# EAGLE design OneRelayMysensors (EAGLE 6.5.0)
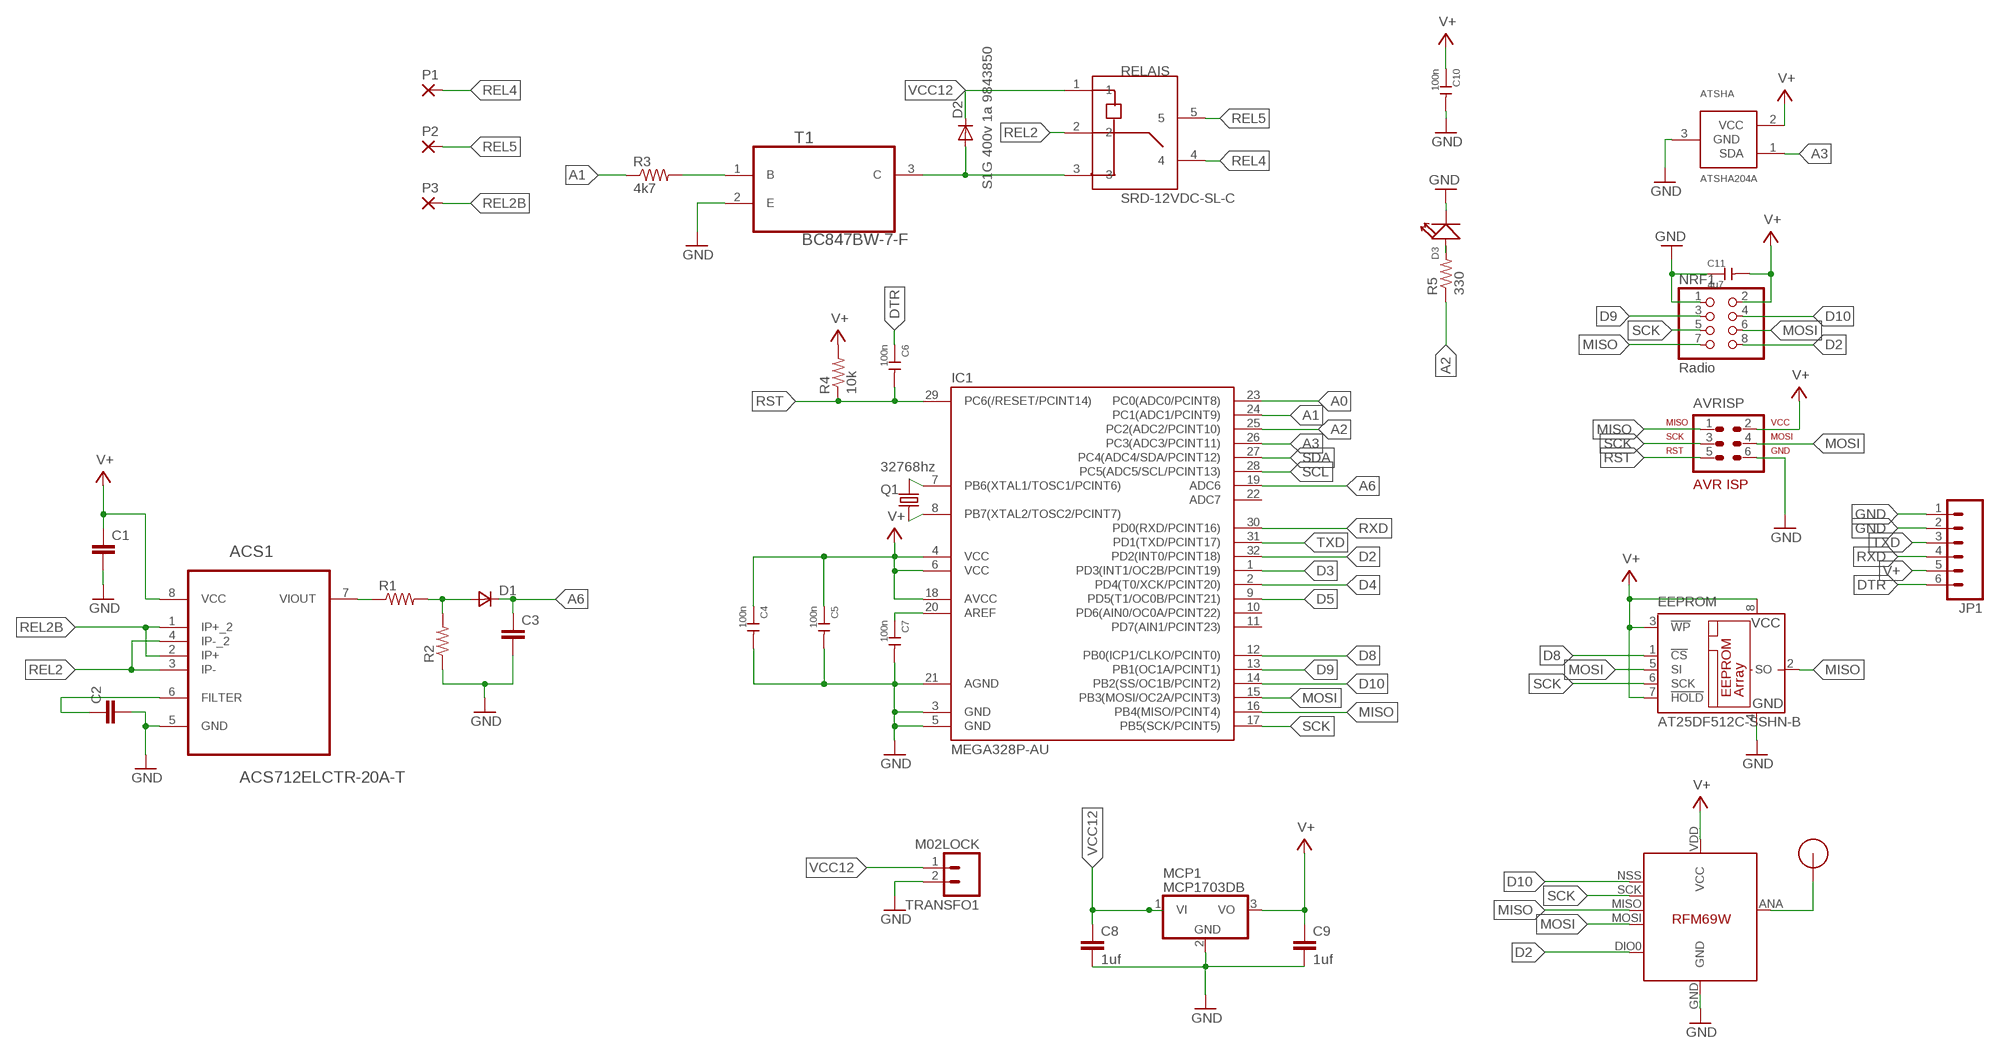
[diagram p0: schematic, sheet 1]

## Parts
$1_28_$  RFM12B_ANTENNA  [RFM12B-ANTENNA]
ACS1  ACS712ELCTR-20A-T  [SOIC127P600X175-8N]
ATSHA  ATSHA204A  [SOT23]
AVRISP  AVR-ISP-6VERT  [AVR-ISP-6]
C1  CAP0805  [0805]
C2  CAP0805  [0805]
C3  CAP0805  [0805]
C4  100n  CAP-1206  [C1206]
C5  100n  CAP-1206  [C1206]
C6  100n  CAP-1206  [C1206]
C7  100n  CAP-1206  [C1206]
C8  1uf  CAP1206  [1206]
C9  1uf  CAP1206  [1206]
C10  100n  CAP-1206  [C1206]
C11  4u7  CAP-1206  [C1206]
D1  DSOD323  [SOD323]
D2  S1G 400v 1a 9843850  DIODE-DO214AC  [DO214AC]
D3  LED-0805  [LED-0805]
EEPROM  AT25DF512C-SSHN-B  25AA080SN  [SO-08]
IC1  MEGA328P-AU  MEGA48/88/168-AU  [TQFP32-08]
JP1  M06NO_SILK_FEMALE_PTH  [1X06_NO_SILK]
MCP1  MCP1703DB  [SOT223]
NRF1  Radio  PINHD-2X4  [2X04]
P1  2,54/1,1  [2,54/1,1]
P2  2,54/1,1  [2,54/1,1]
P3  2,54/1,1  [2,54/1,1]
Q1  32768hz  CRYSTAL-306010055  [2P-L3.2XW1.5MM]
R1  RESISTOR0805-RES  [0805]
R2  RESISTOR0805-RES  [0805]
R3  4k7  RESISTOR1206  [1206]
R4  10k  RESISTOR1206  [1206]
R5  330  RESISTOR1206  [1206]
RELAIS  SRD-12VDC-SL-C  [SRD-12VDC-SL-C]
RFM1  RFM69  [RFM69W-MINPADS]
T1  BC847BW-7-F  [SOT65P210X110-3N]
TRANSFO1  M02LOCK  [1X02_LOCK]

## Nets
A0: IC1.23(PC0(ADC0/PCINT8))
A1: IC1.24(PC1(ADC1/PCINT9)) R3.1
A2: IC1.25(PC2(ADC2/PCINT10)) R5.1
A3: ATSHA.1(SDA) IC1.26(PC3(ADC3/PCINT11))
A6: C3.1 D1.1(C) IC1.19(ADC6)
D2: IC1.32(PD2(INT0/PCINT18)) NRF1.8 RFM1.DIO0
D3: IC1.1(PD3(INT1/OC2B/PCINT19))
D4: IC1.2(PD4(T0/XCK/PCINT20))
D5: IC1.9(PD5(T1/OC0B/PCINT21))
D8: EEPROM.1(!CS) IC1.12(PB0(ICP1/CLKO/PCINT0))
D9: IC1.13(PB1(OC1A/PCINT1)) NRF1.3
D10: IC1.14(PB2(SS/OC1B/PCINT2)) NRF1.4 RFM1.NSS(SEL)
DTR: C6.1 JP1.6
GND [Power]: ACS1.5(GND) ATSHA.3(GND) AVRISP.6 C1.2 C2.2 C3.2 C4.2 C5.2 C7.2 C8.2 C9.2 C10.2 C11.1 D3.- EEPROM.4(GND) IC1.3(GND) IC1.5(GND) IC1.21(AGND) JP1.1 JP1.2 MCP1.2(GND) NRF1.1 R2.1 RFM1.GND T1.2(E) TRANSFO1.2
MISO: AVRISP.1 EEPROM.2(SO) IC1.16(PB4(MISO/PCINT4)) NRF1.7 RFM1.MISO
MOSI: AVRISP.4 EEPROM.5(SI) IC1.15(PB3(MOSI/OC2A/PCINT3)) NRF1.6 RFM1.MOSI
N$1: IC1.7(PB6(XTAL1/TOSC1/PCINT6)) Q1.1
N$2: IC1.8(PB7(XTAL2/TOSC2/PCINT7)) Q1.2
N$3: D3.+ R5.2
N$4: C7.1 IC1.20(AREF)
N$5: $1_28_$.P$1 RFM1.ANA(ANT)
N$8: D2.A RELAIS.3 T1.3(C)
N$10: R3.2 T1.1(B)
N$14: ACS1.6(FILTER) C2.1
N$16: ACS1.7(VIOUT) R1.1
N$17: D1.2(A) R1.2 R2.2
REL2: ACS1.3(IP-) ACS1.4(IP-_2) RELAIS.2
REL2B: ACS1.1(IP+_2) ACS1.2(IP+) P3.1(P)
REL4: P1.1(P) RELAIS.4
REL5: P2.1(P) RELAIS.5
RST: AVRISP.5 C6.2 IC1.29(PC6(/RESET/PCINT14)) R4.1
RXD: IC1.30(PD0(RXD/PCINT16)) JP1.4
SCK: AVRISP.3 EEPROM.6(SCK) IC1.17(PB5(SCK/PCINT5)) NRF1.5 RFM1.SCK
SCL: IC1.28(PC5(ADC5/SCL/PCINT13))
SDA: IC1.27(PC4(ADC4/SDA/PCINT12))
TXD: IC1.31(PD1(TXD/PCINT17)) JP1.3
V+ [Power]: ACS1.8(VCC) ATSHA.2(VCC) AVRISP.2 C1.1 C4.1 C5.1 C9.1 C10.1 C11.2 EEPROM.3(!WP) EEPROM.7(!HOLD) EEPROM.8(VCC) IC1.4(VCC) IC1.6(VCC) IC1.18(AVCC) JP1.5 MCP1.3(VO) NRF1.2 R4.2 RFM1.VDD(VCC)
VCC12: C8.1 D2.C MCP1.1(VI) RELAIS.1 TRANSFO1.1
Unconnected: IC1.10(PD6(AIN0/OC0A/PCINT22)) IC1.11(PD7(AIN1/PCINT23)) IC1.22(ADC7)

## Library data of the parts
$1_28_$ = LowPowerLab:RFM12B_ANTENNA
ACS1 = pmo_lib:ACS712ELCTR-20A-T: Linear Current Sensor; MPN: ACS712ELCTR-20A-T; OC_FARNELL: 1329624; OC_NEWARK: 31M3133; PACKAGE: SOIC-8; SUPPLIER: Allegro
ATSHA = Sensor:ATSHA204A
AVRISP = avr-7:AVR-ISP-6: AVR ISP-6 Serial Programming Header
C1-C3 = SparkFun-Passives:CAP: Capacitor Standard 0603 ceramic capacitor, and 0.1" leaded capacitor.
C4-C7 C10 C11 = Discrete:CAP: Ceramic Capacitors
C8 C9 = SparkFun-Capacitors:CAP: Capacitor Standard 0603 ceramic capacitor, and 0.1" leaded capacitor.
D1 = zetex:D: DIODE; MPN: CDSOD323-T05C; OC_FARNELL: 1824860; OC_NEWARK: 79R6078
D2 = diode:DIODE-: DIODE
D3 = Discrete:LED
EEPROM = microchip:25*: Serial EEPROM 4K/ 8K , SPI bus; MF: MICROCHIP; MPN: 25AA080/SN; OC_FARNELL: 1816072; OC_NEWARK: 92C7351
IC1 = avr-7:MEGA48/88/168
JP1 = SparkFun-Connectors:M06: Header 6 Standard 6-pin 0.1" header. Use with straight break away headers (SKU : PRT-00116), right angle break away headers (PRT-00553), swiss pins (PRT-00743), machine pins (PRT-00117), and female headers (PRT-00115). Molex polarized connector foot print use with SKU : PRT-08094 with associated crimp pins and housings. NOTES ON THE VARIANTS LOCK and LOCK_LONGPADS... This footprint was designed to help hold the alignment of a through-hole component (i.e. 6-pin header) while soldering it into place. You may notice that each hole has been shifted either up or down by 0.005 of an inch from it's more standard position (which is a perfectly straight line). This slight alteration caused the pins (the squares in the middle) to touch the edges of the holes. Because they are alternating, it causes a "brace" to hold the component in place. 0.005 has proven to be the perfect amount of "off-center" position when using our standard breakaway headers. Although looks a little odd when you look at the bare footprint, once you have a header in there, the alteration is very hard to notice. Also,if you push a header all the way into place, it is covered up entirely on the bottom side. This idea of altering the position of holes to aid alignment will be further integrated into the Sparkfun Library for other footprints. It can help hold any component with 3 or more connection pins.; PROD_ID: CONN-08437
MCP1 = linear:MCP1703: 250 mA, 16V, Low Quiescent Current LDO Regulator Source: http://ww1.microchip.com/downloads/en/DeviceDoc/22049b.pdf
NRF1 = pinhead:PINHD-2X4: PIN HEADER
P1-P3 = wirepad:2,54/1,1: THROUGH-HOLE PAD
Q1 = Discrete:CRYSTAL*
R1-R3 = SparkFun-Resistors:RESISTOR: Resistor Basic schematic elements and footprints for 0603, 1206, and PTH resistors.
R4 R5 = SparkFun-Passives:RESISTOR: Resistor Basic schematic elements and footprints for 0603, 1206, and PTH resistors.
RELAIS = pmo_lib:SRD-12VDC-SL-C
RFM1 = LowPowerLab:RFM69
T1 = pmo_lib:BC847BW-7-F: TRANSISTOR; MPN: BC847BW-7-F; OC_FARNELL: 1773619; OC_NEWARK: 51R6394; PACKAGE: SOT-323-3; SUPPLIER: Diodes Inc
TRANSFO1 = SparkFun-Connectors:M02: Standard 2-pin 0.1" header. Use with - straight break away headers ( PRT-00116) - right angle break away headers (PRT-00553) - swiss pins (PRT-00743) - machine pins (PRT-00117) - female headers (PRT-00115) Molex polarized connector foot print use with: PRT-08233 with associated crimp pins and housings. 2.54_SCREWTERM for use with PRT-10571. 3.5mm Screw Terminal footprints for PRT-08084 5mm Screw Terminal footprints for use with PRT-08433

## Net classes
0 default: width 0.203 mm
1 Power: width 0.406 mm

## Board
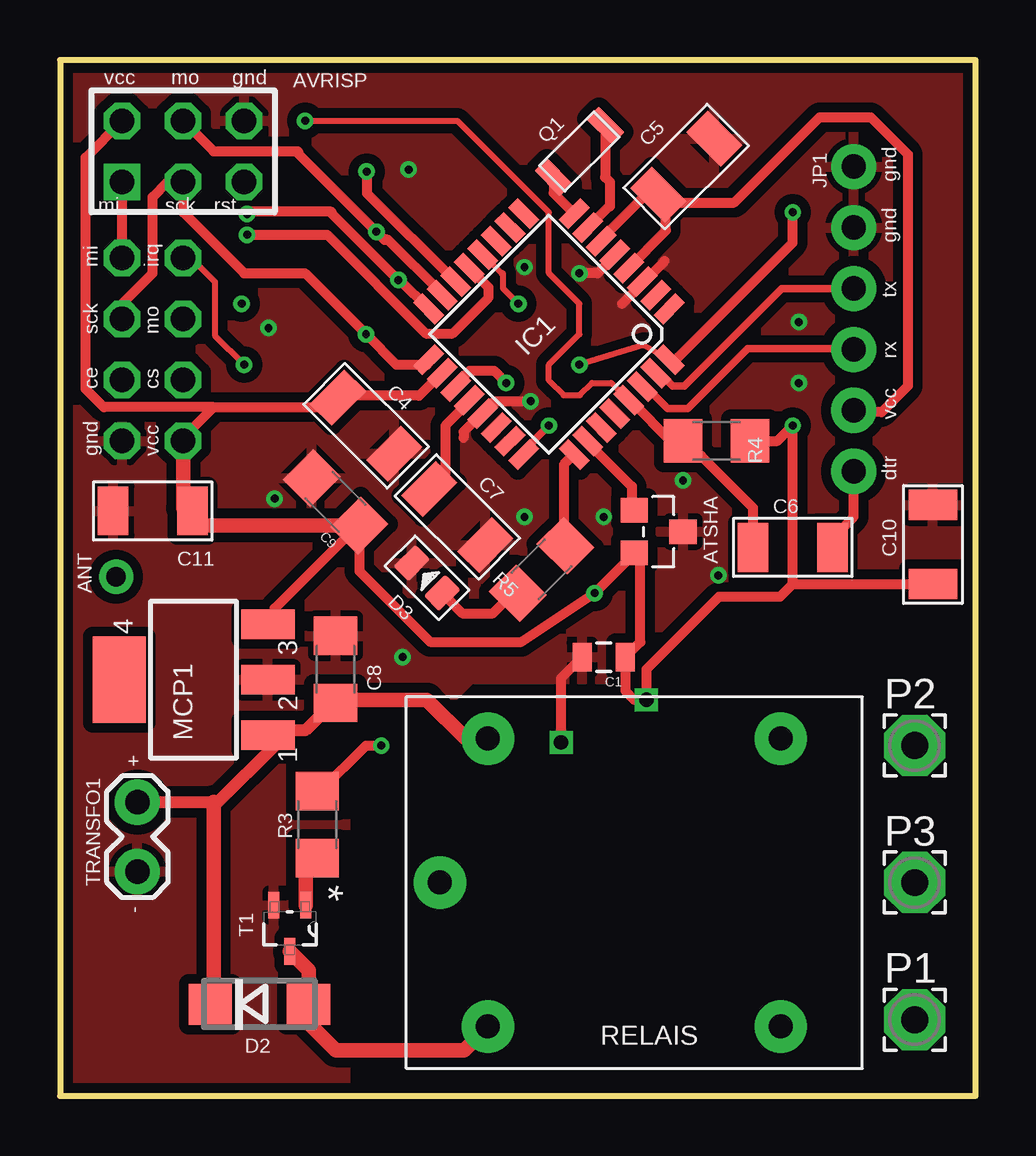
[diagram p1: board, top side]
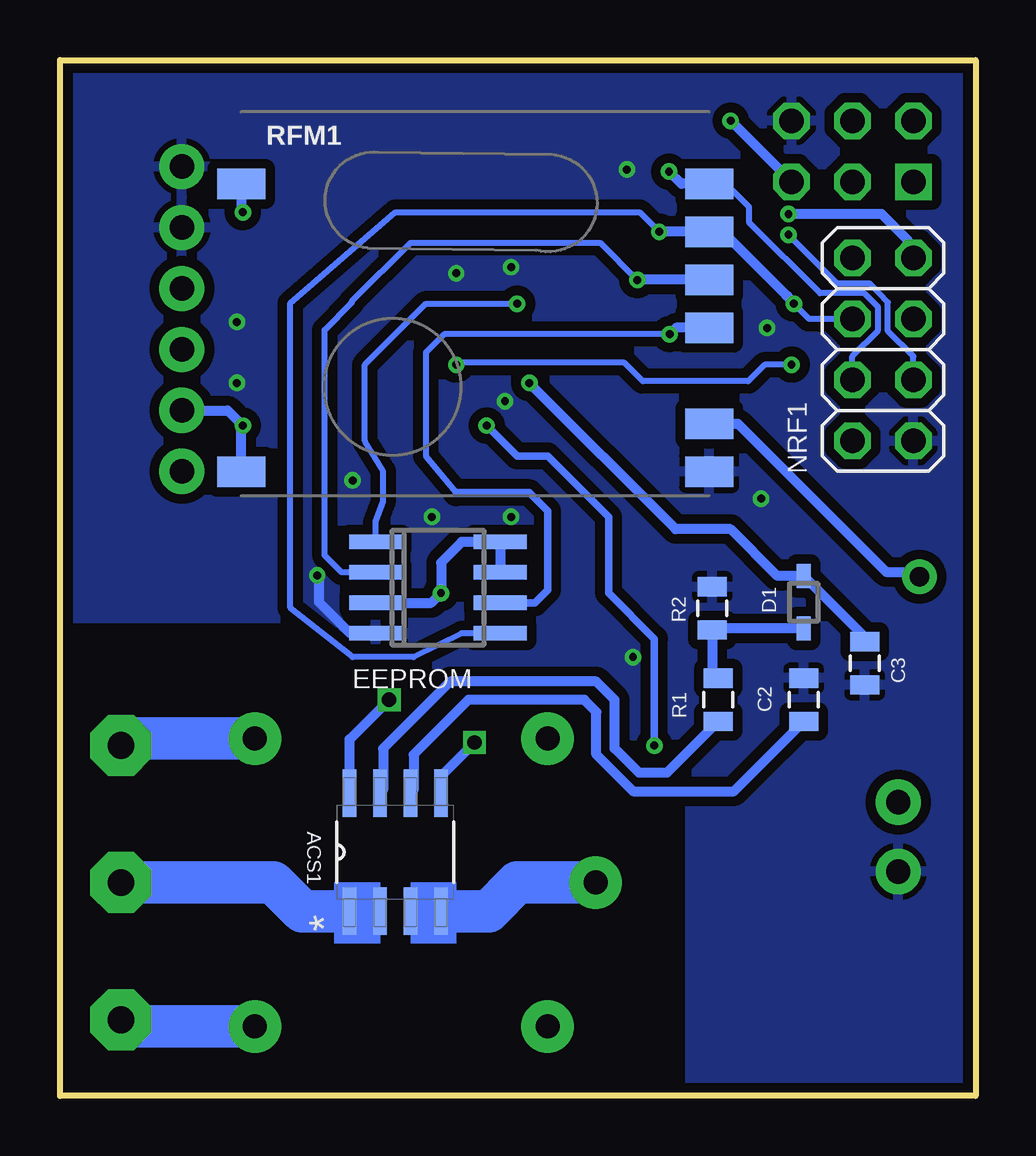
[diagram p2: board, bottom side, seen from below]

Size 38.15 x 43.18 mm. Coordinates in mm from the lower left corner, seen from the top.
Outline: 0,0 38.15,0 38.15,43.18 0,43.18 0,0
Copper layers (1*16): Top 0.0356mm / dielectric 1.5011mm / Bottom 0.0356mm
Design rules "LaenPCBOrder": minimum track width 6mil, minimum drill 13mil, track to track 6mil, track to pad 6mil, pad to pad 6mil, via to via 6mil, smd to smd 6mil, copper to edge 15mil, drill to drill 6mil, minimum pad ring 7mil, minimum via ring 7mil, stop-mask expansion 3mil, vias tented up to drill 0mil, thermal gap 10mil

### Footprints (pad centres in the part's own frame; a part is rotated, then mirrored left to right if it is on the bottom)
RFM12B-ANTENNA = drill 0.8 pad 1.422: P$1 0,0
SOIC127P600X175-8N = smd 1.981 x 0.559: 1 -2.464,1.905; 2 -2.464,0.635; 3 -2.464,-0.635; 4 -2.464,-1.905; 5 2.464,-1.905; 6 2.464,-0.635; 7 2.464,0.635; 8 2.464,1.905
SOT23 = smd 1.016 x 1.143: 1 -0.889,-1.016; 2 0.889,-1.016; 3 0,1.016
AVR-ISP-6 = drill 1.016 square: 1 -2.54,-1.27 | drill 1.016 octagon: 2 -2.54,1.27; 3 0,-1.27; 4 0,1.27; 5 2.54,-1.27; 6 2.54,1.27
0805 = smd 0.8 x 1.2: 1 -0.9,0; 2 0.9,0
C1206 = smd 1.27 x 2.032: 1 -1.651,0; 2 1.651,0
1206 = smd 1.6 x 1.8: 1 -1.4,0; 2 1.4,0
SOD323 = smd 1 x 0.6: 1 -1.1,0; 2 1.1,0
DO214AC = smd 1.8 x 1.7: A 2.05,0; C -2.05,0
LED-0805 = smd 0.889 x 1.27: + -0.889,0; - 0.889,0
SO-08 = smd 0.6 x 2.2: 1 -1.905,-2.6; 2 -0.635,-2.6; 3 0.635,-2.6; 4 1.905,-2.6; 5 1.905,2.6; 6 0.635,2.6; 7 -0.635,2.6; 8 -1.905,2.6
TQFP32-08 = smd 1.27 x 0.559: 1 -4.293,2.8; 2 -4.293,2; 3 -4.293,1.2; 4 -4.293,0.4; 5 -4.293,-0.4; 6 -4.293,-1.2; 7 -4.293,-2; 8 -4.293,-2.8; 17 4.293,-2.8; 18 4.293,-2; 19 4.293,-1.2; 20 4.293,-0.4; 21 4.293,0.4; 22 4.293,1.2; 23 4.293,2; 24 4.293,2.8 | smd 0.559 x 1.27: 9 -2.8,-4.293; 10 -2,-4.293; 11 -1.2,-4.293; 12 -0.4,-4.293; 13 0.4,-4.293; 14 1.2,-4.293; 15 2,-4.293; 16 2.8,-4.293; 25 2.8,4.293; 26 2,4.293; 27 1.2,4.293; 28 0.4,4.293; 29 -0.4,4.293; 30 -1.2,4.293; 31 -2,4.293; 32 -2.8,4.293
1X06_NO_SILK = drill 1.016 pad 1.88: 1 0,0; 2 2.54,0; 3 5.08,0; 4 7.62,0; 5 10.16,0; 6 12.7,0
SOT223 = smd 1.219 x 2.235: 1 -2.311,-3.099; 2 0,-3.099; 3 2.311,-3.099 | smd 3.6 x 2.2: 4 0,3.099
2X04 = drill 1.016 octagon: 1 -3.81,-1.27; 2 -3.81,1.27; 3 -1.27,-1.27; 4 -1.27,1.27; 5 1.27,-1.27; 6 1.27,1.27; 7 3.81,-1.27; 8 3.81,1.27
2,54/1,1 = drill 1.118 pad 2.54 octagon: 1 0,0
2P-L3.2XW1.5MM = smd 0.762 x 1.524: 1 -1.524,0; 2 1.524,0
SRD-12VDC-SL-C = drill 1 pad 2.184: 1 0,6; 2 -2,0; 3 0,-6; 4 12.2,-6; 5 12.2,6
RFM69W-MINPADS = smd 2 x 1.27: ANA 8,-5; DIO0 -11.5,5; GND 8,-7; MISO 8,1; MOSI 8,3; NSS 8,5; SCK 8,-1; VDD -11.5,-7
SOT65P210X110-3N = smd 1.118 x 0.457: 1 -0.965,0.66; 2 -0.965,-0.66; 3 0.965,0
1X02_LOCK = drill 1.016 pad 1.88: 1 -0.178,0; 2 2.718,0

### Placement (x,y rotation side)
$1_28_$  2.34,21.64 0 top
ACS1  24.18,10.16 90 bottom
ATSHA  24.94,23.52 270 top
AVRISP  5.13,39.37 0 top
C1  22.66,18.29 180 top
C2  7.16,16.51 90 bottom
C3  4.62,18.03 270 bottom
C4  12.75,27.94 315 top
C5  26.09,38.73 45 top
C6  30.53,22.86 180 top
C7  16.56,24.13 315 top
C8  11.48,17.78 90 top
C9  11.48,24.77 135 top
C10  36.37,22.99 90 top
C11  3.86,24.38 0 top
D1  7.16,20.57 270 bottom
D2  8.31,3.81 0 top
D3  15.29,21.59 135 top
EEPROM  22.4,21.18 270 bottom
IC1  20.37,31.75 225 top
JP1  33.07,38.73 270 top
MCP1  5.56,17.35 90 top
NRF1  3.86,31.11 90 bottom
P1  35.61,3.17 0 top
P2  35.61,14.61 0 top
P3  35.61,8.89 0 top
Q1  21.64,39.37 225 top
R1  10.72,16.51 90 bottom
R2  10.97,20.32 270 bottom
R3  10.72,11.3 270 top
R4  27.36,27.3 0 top
R5  20.07,21.95 225 top
RELAIS  17.83,8.89 0 top
RFM1  19.1,33.02 0 bottom
T1  9.58,6.99 270 top
TRANSFO1  3.23,12.06 270 top

### Tracks (layer width: path | path; a pad name or v marks a point on that pad's centre or on a via)
A1  (via drill 0.33 pad 0.61)
  Top 0.305: IC1.24 19.32,26.89 v20.37,27.94
  Top 0.406: R3.1 10.85,12.7 12.75,14.61 v13.39,14.61
  Bottom 0.305: v13.39,14.61 13.39,19.05 15.29,20.95 15.29,24.13 17.83,26.67 19.1,26.67 v20.37,27.94
A2
  Top 0.406: IC1.25 21,26.31 21,22.99 R5.1
A3
  Top 0.406: IC1.26 21.99,27.23 23.82,25.4 23.82,24.51 ATSHA.1
A6  (via drill 0.33 pad 0.61)
  Top 0.406: IC1.19 16.49,29.64 17.07,30.23 18.08,30.23 v18.59,29.72
  Bottom 0.406: v18.59,29.72 12.5,23.62 10.21,23.62 8.26,21.67 D1.1 4.62,19.13 C3.1
D2  (via drill 0.33 pad 0.61)
  Top 0.254: NRF1.8 5.46,34.92 6.45,33.93 6.45,31.7 v7.67,30.48 | IC1.32 24.31,31.29 v21.64,30.48
  Top 0.406: IC1.32 25.67,30.7 30.53,35.56 v30.53,36.83
  Bottom 0.254: v7.67,30.48 8.79,30.48 9.47,29.79 13.87,29.79 14.63,30.56 21.56,30.56 v21.64,30.48
  Bottom 0.406: RFM1.DIO0 30.6,36.9 v30.53,36.83
D8  (via drill 0.33 pad 0.61)
  Top 0.254: v19.1,33.02 18.47,33.66 18.47,34.29 18.4,34.29 IC1.12
  Bottom 0.254: EEPROM.1 25,23.94 24.69,24.77 24.69,26.04 25.45,27.3 25.45,30.48 22.91,33.02 v19.1,33.02
D9  (via drill 0.33 pad 0.61)
  Top 0.406: v7.8,35.89 11.12,35.89 15.24,31.77 16.36,31.77 17.86,33.27 17.86,33.7 IC1.13
  Bottom 0.254: NRF1.3 2.59,30.84 3.66,31.88 3.66,33.07 4.42,33.86 5.77,33.86 v7.8,35.89
D10  (via drill 0.33 pad 0.61)
  Top 0.406: IC1.14 12.8,37.62 12.8,38.51 v12.78,38.53
  Bottom 0.254: NRF1.4 5.13,30.84 4.06,31.9 4.06,32.87 4.65,33.45 6.48,33.45 9.45,36.42 9.45,37.06 10.41,38.02 RFM1.NSS
  Bottom 0.406: RFM1.NSS 12.26,38.02 v12.78,38.53
DTR
  Top 0.406: C6.1 32.18,23.24 33.07,24.13 JP1.6
GND  (via drill 0.33 pad 0.61, 0.6)
  Top 0.406: v20.88,14.73 20.88,17.41 C1.2 | 25.2,34.8 24.34,33.94 IC1.3 24.25,33.86 23.42,33.02 | IC1.5 23.12,35.01 22.4,34.29 v21.64,34.29 | 16.81,27.43 16.81,27.69 17.56,28.43 IC1.21 17.62,28.49 18.08,28.96 v19.61,28.96
  Bottom 0.406: EEPROM.4 25.03,19.25 26.03,19.25 27.36,20.57 27.36,21.61 v27.43,21.69 | ACS1.5 22.28,13.34 v20.88,14.73
  other vias: 25.96,25.65 19.35,34.54 19.35,24.13 30.78,32.26 14.53,38.61 8.69,32 14.27,18.29 22.66,24.13 30.78,29.72 8.94,24.89
  pour Bottom (isolate 0.406, rank 6): -7.57,45.72 -7.57,-2.54 41.96,-2.54 41.96,45.72
  pour Top (isolate 0.406, rank 6): -5.03,-3.81 43.23,-3.81 43.23,46.99 -5.03,46.99
MISO  (via drill 0.33 pad 0.61)
  Top 0.406: NRF1.7 AVRISP.1 | IC1.16 14.15,34.01 v14.1,34.01 11.31,36.8 11.31,36.85 7.9,36.85 v7.8,36.75
  Bottom 0.254: EEPROM.2 26.42,21.82 27.13,22.53 27.13,31.93 25.98,33.07 25.98,33.12 23.55,35.56 15.65,35.56 v14.1,34.01
  Bottom 0.406: v14.1,34.01 14.09,34.02 RFM1.MISO 10.93,34.19 | v7.8,36.75 3.91,36.75 2.84,35.69 2.84,35.18 NRF1.7
MOSI  (via drill 0.33 pad 0.61)
  Top 0.406: AVRISP.4 6.4,39.37 9.92,39.37 9.92,39.28 v13.18,36.02 13.51,35.69 13.66,35.69 15.92,33.43 IC1.15
  Bottom 0.254: NRF1.6 6.93,32.38 v7.57,33.02 | EEPROM.5 21.41,19.28 23.42,18.29 25.96,18.29 28.55,20.34 28.55,33.05 24.18,36.83 14,36.83 v13.18,36.02
  Bottom 0.406: v7.57,33.02 7.9,33.38 10.57,36.04 11.08,36.04 RFM1.MOSI v13.18,36.02
N$1
  Top 0.406: Q1.1 22.72,38.29 22.91,38.1 22.91,37.08 22.88,37.08 IC1.7
N$2
  Top 0.406: Q1.2 20.56,37.63 IC1.8
N$3
  Top 0.406: D3.+ 16.76,20.12 18.03,20.12 18.87,20.96 R5.2
N$4
  Top 0.406: IC1.20 17.05,28.94 16.05,27.94 16.05,25.96 C7.1
N$5
  Bottom 0.406: RFM1.ANA 9.91,28.02 3.73,21.84 2.39,21.84 $1_28_$.P$1
N$8
  Top 0.61: T1.3 10.36,5.24 D2.A 10.36,3.03 11.48,1.91 16.85,1.91 RELAIS.3
N$9
  cutout Bottom (rank 2): 38.15,19.68 27.99,19.68 26.09,17.78 18.59,17.78 16.56,15.75 16.56,13.97 16.05,12.95 12.12,12.06 12.12,0 38.15,0
N$10
  Top 0.61: T1.1 10.24,9.42 R3.2
N$11
  cutout Top: 12.12,0 38.15,0 38.15,19.68 27.99,19.68 25.45,17.14 17.2,17.14 12.12,12.06
N$14
  Bottom 0.406: ACS1.6 23.42,12.75 23.42,14.22 21.13,16.51 16.31,16.51 15.8,16 15.8,14.22 14.27,12.7 10.07,12.7 C2.1
N$16
  Bottom 0.406: ACS1.7 24.69,12.75 24.69,14.48 21.89,17.27 15.8,17.27 15.04,16.51 15.04,14.48 14.02,13.46 12.87,13.46 R1.1
N$17
  Bottom 0.406: D1.2 10.92,19.47 R2.2 10.97,17.66 R1.2
REL2
  Bottom 0.406: ACS1.3 ACS1.4
  Bottom 1.778: ACS1.4 20.29,7.7 19.1,8.89 RELAIS.2
REL2B
  Bottom 0.406: ACS1.1 ACS1.2
  Bottom 1.778: ACS1.1 28.07,7.7 29.26,8.89 P3.1
REL4
  Bottom 1.778: RELAIS.4 35.61,2.89 P1.1
REL5
  Bottom 1.778: RELAIS.5 35.61,14.89 P2.1
RST  (via drill 0.33 pad 0.61)
  Top 0.254: v10.21,40.64 16.56,40.64 20.37,36.83 20.37,34.29 21.64,33.02 21.64,31.75 20.37,30.48 20.37,29.82 20.98,29.21 21.67,29.21 22.17,29.72 22.97,29.72 IC1.29
  Top 0.406: IC1.29 23.69,28.94 23.82,28.94 25.45,27.3 R4.1 26.59,26.67 26.72,26.67 28.88,24.51 C6.2
  Bottom 0.406: AVRISP.5 v10.21,40.64
RXD
  Top 0.305: IC1.30 24.41,29.56 25.32,28.65 26.16,28.65 28.65,31.14 33.05,31.14 JP1.4
SCK  (via drill 0.33 pad 0.61)
  Top 0.406: IC1.17 15.36,30.55 15.29,30.48 14.02,30.48 v12.75,31.75 10.21,34.29 7.67,34.29 5.13,36.83 AVRISP.3 4.5,38.1 3.86,37.47 3.86,34.29 2.59,33.02 NRF1.5
  Bottom 0.254: 21.64,25.15 22.91,26.67 22.91,30.99 22.15,31.75 v12.75,31.75
  Bottom 0.305: EEPROM.6 18.36,20.55 17.83,21.08 17.83,24.38 18.59,25.15 21.64,25.15
  Bottom 0.406: RFM1.SCK 12.48,32.02 v12.75,31.75
TXD
  Top 0.305: IC1.31 24.99,30.13 25.53,29.59 26.01,29.59 30.07,33.66 JP1.3
V+  (via drill 0.33 pad 0.61, 0.6)
  Top 0.406: IC1.6 22.56,35.72 24.33,37.49 24.84,37.49 C5.1 | 24.43,37.59 24.89,37.59 C5.1 | 6.4,28.7 1.83,28.7 1.07,29.46 1.07,39.12 AVRISP.2 | 5.13,24.51 C11.2 6.12,23.77 | NRF1.2 5.13,27.43 6.4,28.7 | 6.4,28.7 11.18,28.7 C4.1 11.66,29.18 | IC1.18 15.9,30.13 14.96,29.18 11.66,29.18 | 11.66,29.18 11.46,29.18 | MCP1.3 8.94,19.94 8.94,20.32 12.4,23.77 C9.1 12.47,21.87 15.42,18.92 19.23,18.92 v22.28,20.95 23.93,22.61 ATSHA.2 24.18,22.38 24.18,18.91 C1.1 23.56,16.88 23.93,16.51 v24.43,16.51 24.43,17.78 27.46,20.8 30,20.8 30.53,21.34 | C5.1 24.82,37.47 24.82,37.64 24.87,37.69 24.87,37.24 28.09,37.24 31.65,40.79 33.78,40.79 35.33,39.24 35.33,29.59 34.24,28.5 33.15,28.5 JP1.5 | IC1.4 25.25,36.07 25.25,37.24 C5.1 | 30.53,21.34 C10.1 | R4.2 29.9,27.3 v30.53,27.94 30.53,21.34
  Top 0.61: NRF1.2 5.13,24.51 | C9.1 6.12,23.77
  Bottom 0.406: 30.71,25.91 RFM1.VDD 30.6,27.87 v30.53,27.94 31.17,28.57 JP1.5 | EEPROM.7 EEPROM.8 21.41,23.09 22.28,22.23 v22.28,20.95 22.68,20.55 EEPROM.3 | ACS1.8 26.09,14.86 v24.43,16.51
VCC12
  Top 0.508: C8.1 11.35,16.38 10.21,15.24 8.86,15.24 MCP1.1 8.94,14.76 8.94,14.61 6.58,12.24 6.4,12.24 TRANSFO1.1
  Top 0.61: RELAIS.1 16.91,14.89 15.29,16.51 11.61,16.51 C8.1 | D2.C 6.4,3.81 6.4,12.24
(copper drawn outside any net)
  shapes: Bottom area x2

### Text on the board
tPlace: vcc | mo | gnd | gnd | mi | sck | rst | gnd | mi | irq | tx | sck | mo | rx | ce | cs | vcc | gnd | vcc | dtr | ANT
tNames: + | -